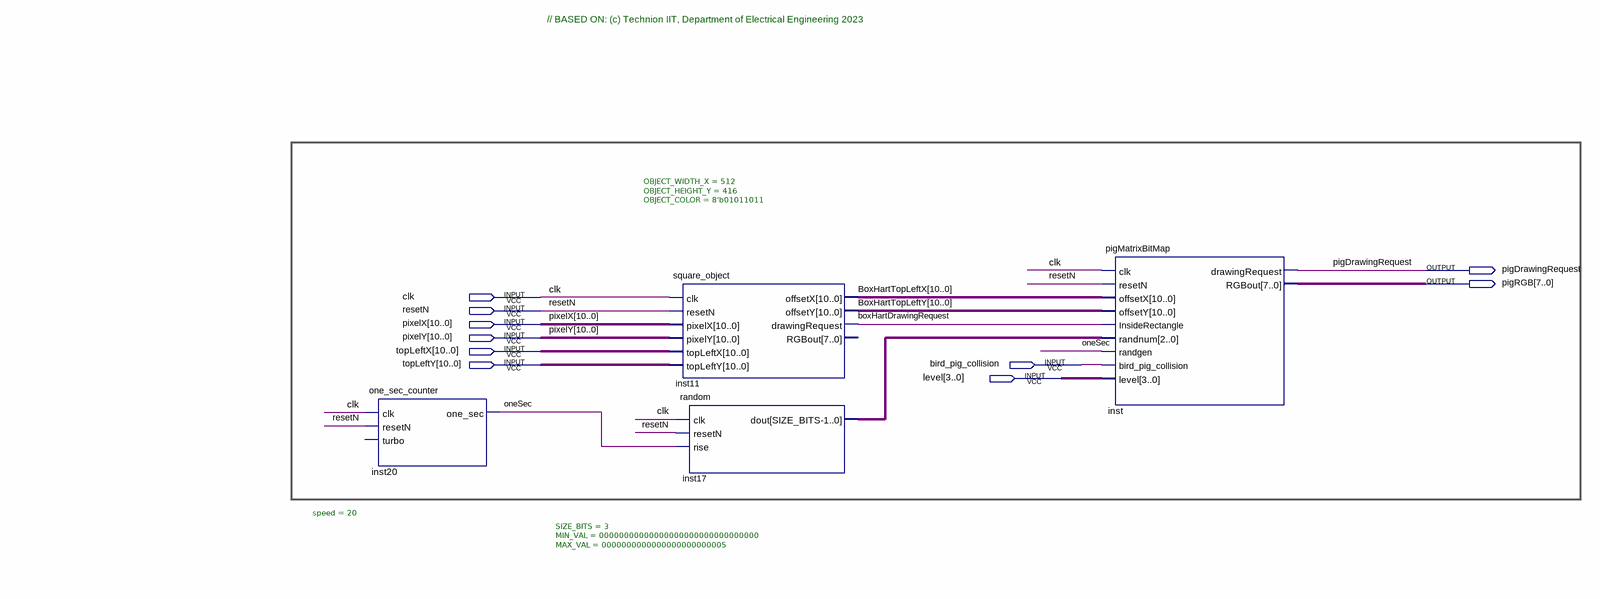
[diagram p0: schematic sheet]
// Quartus schematic PIG_DISPLAY.bdf as structural Verilog: 4 symbols, 10 pins
module PIG_DISPLAY (
  input  clk,
  input  resetN,
  input  [10:0] pixelX,
  input  [10:0] pixelY,
  input  [10:0] topLeftX,
  input  [10:0] topLeftY,
  input  bird_pig_collision,
  input  [3:0] level,
  output pigDrawingRequest,
  output [7:0] pigRGB
);

  wire boxHartDrawingRequest, oneSec;
  wire [2:0] inst17_dout;
  wire [10:0] BoxHartTopLeftX, BoxHartTopLeftY;

  one_sec_counter #(.speed(20)) inst20 (.clk(clk), .resetN(resetN), .one_sec(oneSec));  // open: turbo
  square_object #(.OBJECT_WIDTH_X(512), .OBJECT_HEIGHT_Y(416), .OBJECT_COLOR(8'b01011011)) inst11 (
    .clk(clk), .resetN(resetN), .pixelX(pixelX), .pixelY(pixelY), .topLeftX(topLeftX), .topLeftY(topLeftY),
    .offsetX(BoxHartTopLeftX), .offsetY(BoxHartTopLeftY), .drawingRequest(boxHartDrawingRequest));  // open: RGBout
  random #(.SIZE_BITS(3), .MIN_VAL(00000000000000000000000000000000), .MAX_VAL(0000000000000000000000005)) inst17 (
    .clk(clk), .resetN(resetN), .rise(oneSec), .dout(inst17_dout));
  pigMatrixBitMap inst (
    .clk(clk), .resetN(resetN), .offsetX(BoxHartTopLeftX), .offsetY(BoxHartTopLeftY),
    .InsideRectangle(boxHartDrawingRequest), .randnum(inst17_dout), .randgen(oneSec),
    .bird_pig_collision(bird_pig_collision), .level(level), .drawingRequest(pigDrawingRequest),
    .RGBout(pigRGB));

  // Notes on the sheet:
  //   // BASED ON: (c) Technion IIT, Department of Electrical Engineering 2023
endmodule
